# EAGLE board led-matrix-displayCompl (EAGLE 5.12)
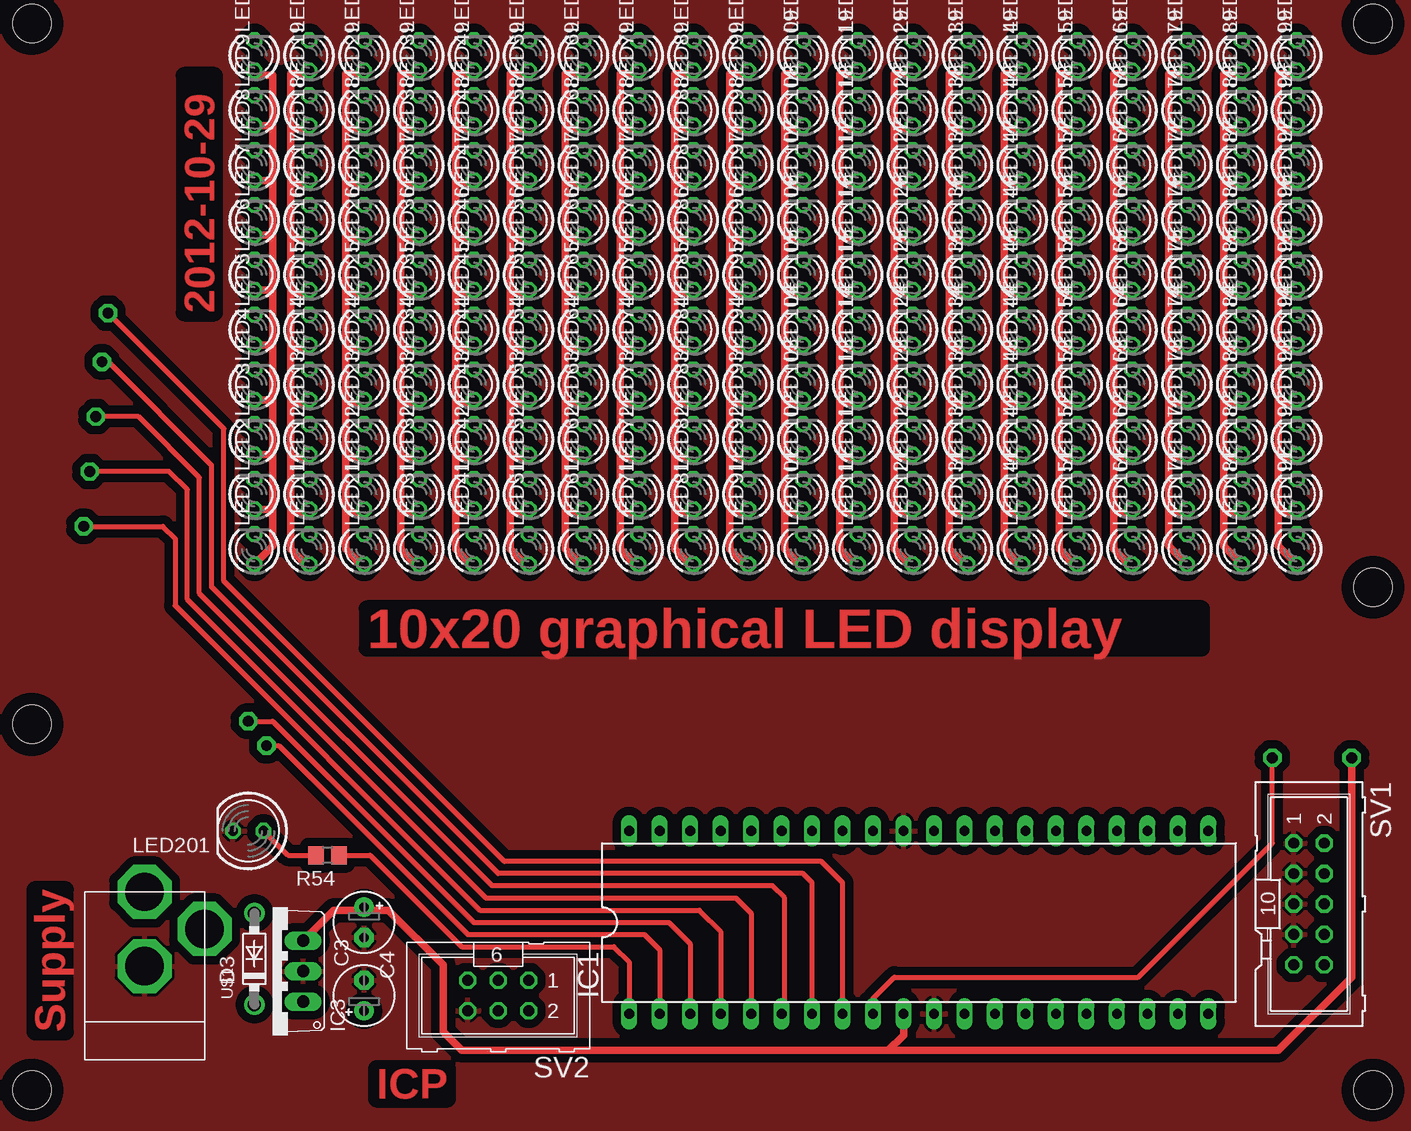
[diagram p1: board, top side]
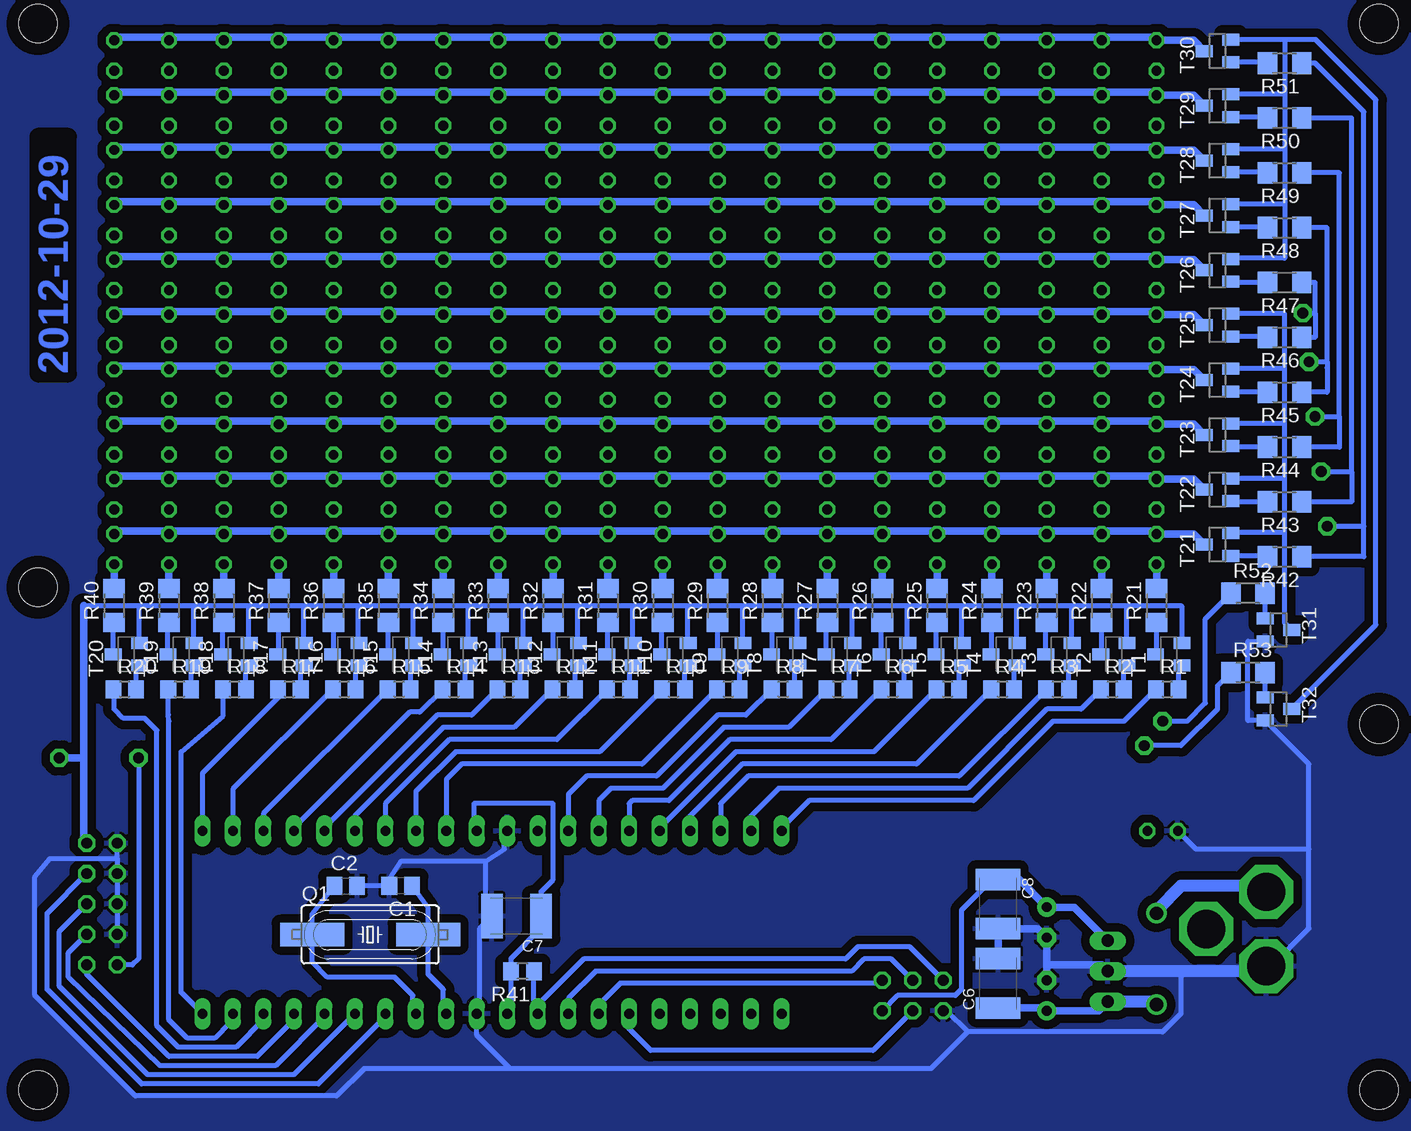
[diagram p2: board, bottom side, seen from below]

No outline drawn. Coordinates in mm, seen from the top.
Copper layers (1*16): Top 0.035mm / dielectric 1.5mm / Bottom 0.035mm
Design rules "default *": minimum track width 16mil, minimum drill 24mil, track to track 12mil, track to pad 12mil, pad to pad 12mil, via to via 8mil, smd to smd 8mil, copper to edge 40mil, drill to drill 8mil, minimum pad ring 10mil, minimum via ring 8mil, stop-mask expansion 4mil, vias tented up to drill 0mil, thermal gap 10mil
Holes 3.2 mm at 105.41,-6.35 105.41,82.55 -6.35,82.55 -6.35,24.13 -6.35,-6.35 105.41,35.56

## Footprints (pad centres in the part's own frame; a part is rotated, then mirrored left to right if it is on the bottom)
C0805 = smd 1.3 x 1.5: 1 -0.95,0; 2 0.95,0
E2,5-5 = drill 0.813 pad 1.6 round: + -1.27,0 | drill 0.813 pad 1.6 octagon: - 1.27,0
C1812K = smd 1.8 x 3.7: 1 -2.05,0; 2 2.05,0
DO41-7.6 = drill 1.1 pad 1.7 round: A 3.81,0; C -3.81,0
DIL40 = drill 0.813 long: 1 -24.13,-7.62; 2 -21.59,-7.62; 3 -19.05,-7.62; 4 -16.51,-7.62; 5 -13.97,-7.62; 6 -11.43,-7.62; 7 -8.89,-7.62; 8 -6.35,-7.62; 9 -3.81,-7.62; 10 -1.27,-7.62; 11 1.27,-7.62; 12 3.81,-7.62; 13 6.35,-7.62; 14 8.89,-7.62; 15 11.43,-7.62; 16 13.97,-7.62; 17 16.51,-7.62; 18 19.05,-7.62; 19 21.59,-7.62; 20 24.13,-7.62; 21 24.13,7.62; 22 21.59,7.62; 23 19.05,7.62; 24 16.51,7.62; 25 13.97,7.62; 26 11.43,7.62; 27 8.89,7.62; 28 6.35,7.62; 29 3.81,7.62; 30 1.27,7.62; 31 -1.27,7.62; 32 -3.81,7.62; 33 -6.35,7.62; 34 -8.89,7.62; 35 -11.43,7.62; 36 -13.97,7.62; 37 -16.51,7.62; 38 -19.05,7.62; 39 -21.59,7.62; 40 -24.13,7.62
TO220V = drill 1.016 long: 1 -2.54,-2.54; 2 0,-2.54; 3 2.54,-2.54
LED3MM = drill 0.813 octagon: A -1.27,0; K 1.27,0
LED5MM = drill 0.813 octagon: A -1.27,0; K 1.27,0
HC49UP = smd 5.334 x 1.93: 1 -4.826,0; 2 4.826,0
R0805 = smd 1.3 x 1.5: 1 -0.95,0; 2 0.95,0
R1206 = smd 1.6 x 1.803: 1 -1.422,0; 2 1.422,0
ML10 = drill 0.914 octagon: 1 -5.08,-1.27; 2 -5.08,1.27; 3 -2.54,-1.27; 4 -2.54,1.27; 5 0,-1.27; 6 0,1.27; 7 2.54,-1.27; 8 2.54,1.27; 9 5.08,-1.27; 10 5.08,1.27
ML6 = drill 0.914 octagon: 1 -2.54,-1.27; 2 -2.54,1.27; 3 0,-1.27; 4 0,1.27; 5 2.54,-1.27; 6 2.54,1.27
SOT23-BEC = smd 1 x 1.4: B -0.95,-1.1; C 0,1.1; E 0.95,-1.1
SOT23 = smd 1 x 1.4: 1 -0.95,-1.1; 2 0.95,-1.1; 3 0,1.1
HOHLBUCHSE = drill 3.2 pad 4.5 octagon: I 0,0; O 6.2,0; O2 3.1,5

## Placement (x,y rotation side)
C1  [C0805]  75.18,10.67 180 bottom
C2  [C0805]  79.76,10.67 0 bottom
C3  [E2,5-5]  21.34,1.52 90 top
C4  [E2,5-5]  21.34,7.62 270 top
C6  [C1812K]  25.4,2.54 90 bottom
C7  [C1812K]  65.53,8.13 180 bottom
C8  [C1812K]  25.4,9.14 270 bottom
D3  1N5817-B  [DO41-7.6]  12.19,4.57 90 top
IC1  MEGA32-P  [DIL40]  67.56,7.62 0 top
IC3  7805TV  [TO220V]  13.72,3.56 90 top
LED1  [LED3MM]  12.19,38.73 90 top
LED2  [LED3MM]  12.19,43.31 90 top
LED3  [LED3MM]  12.19,47.88 90 top
LED4  [LED3MM]  12.19,52.45 90 top
LED5  [LED3MM]  12.19,57.02 90 top
LED6  [LED3MM]  12.19,61.59 90 top
LED7  [LED3MM]  12.19,66.17 90 top
LED8  [LED3MM]  12.19,70.74 90 top
LED9  [LED3MM]  12.19,75.31 90 top
LED10  [LED3MM]  12.19,79.88 90 top
LED11  [LED3MM]  16.76,38.73 90 top
LED12  [LED3MM]  16.76,43.31 90 top
LED13  [LED3MM]  16.76,47.88 90 top
LED14  [LED3MM]  16.76,52.45 90 top
LED15  [LED3MM]  16.76,57.02 90 top
LED16  [LED3MM]  16.76,61.59 90 top
LED17  [LED3MM]  16.76,66.17 90 top
LED18  [LED3MM]  16.76,70.74 90 top
LED19  [LED3MM]  16.76,75.31 90 top
LED20  [LED3MM]  16.76,79.88 90 top
LED21  [LED3MM]  21.34,38.73 90 top
LED22  [LED3MM]  21.34,43.31 90 top
LED23  [LED3MM]  21.34,47.88 90 top
LED24  [LED3MM]  21.34,52.45 90 top
LED25  [LED3MM]  21.34,57.02 90 top
LED26  [LED3MM]  21.34,61.59 90 top
LED27  [LED3MM]  21.34,66.17 90 top
LED28  [LED3MM]  21.34,70.74 90 top
LED29  [LED3MM]  21.34,75.31 90 top
LED30  [LED3MM]  21.34,79.88 90 top
LED31  [LED3MM]  25.91,38.73 90 top
LED32  [LED3MM]  25.91,43.31 90 top
LED33  [LED3MM]  25.91,47.88 90 top
LED34  [LED3MM]  25.91,52.45 90 top
LED35  [LED3MM]  25.91,57.02 90 top
LED36  [LED3MM]  25.91,61.59 90 top
LED37  [LED3MM]  25.91,66.17 90 top
LED38  [LED3MM]  25.91,70.74 90 top
LED39  [LED3MM]  25.91,75.31 90 top
LED40  [LED3MM]  25.91,79.88 90 top
LED41  [LED3MM]  30.48,38.73 90 top
LED42  [LED3MM]  30.48,43.31 90 top
LED43  [LED3MM]  30.48,47.88 90 top
LED44  [LED3MM]  30.48,52.45 90 top
LED45  [LED3MM]  30.48,57.02 90 top
LED46  [LED3MM]  30.48,61.59 90 top
LED47  [LED3MM]  30.48,66.17 90 top
LED48  [LED3MM]  30.48,70.74 90 top
LED49  [LED3MM]  30.48,75.31 90 top
LED50  [LED3MM]  30.48,79.88 90 top
LED51  [LED3MM]  35.05,38.73 90 top
LED52  [LED3MM]  35.05,43.31 90 top
LED53  [LED3MM]  35.05,47.88 90 top
LED54  [LED3MM]  35.05,52.45 90 top
LED55  [LED3MM]  35.05,57.02 90 top
LED56  [LED3MM]  35.05,61.59 90 top
LED57  [LED3MM]  35.05,66.17 90 top
LED58  [LED3MM]  35.05,70.74 90 top
LED59  [LED3MM]  35.05,75.31 90 top
LED60  [LED3MM]  35.05,79.88 90 top
LED61  [LED3MM]  39.62,38.73 90 top
LED62  [LED3MM]  39.62,43.31 90 top
LED63  [LED3MM]  39.62,47.88 90 top
LED64  [LED3MM]  39.62,52.45 90 top
LED65  [LED3MM]  39.62,57.02 90 top
LED66  [LED3MM]  39.62,61.59 90 top
LED67  [LED3MM]  39.62,66.17 90 top
LED68  [LED3MM]  39.62,70.74 90 top
LED69  [LED3MM]  39.62,75.31 90 top
LED70  [LED3MM]  39.62,79.88 90 top
LED71  [LED3MM]  44.2,38.73 90 top
LED72  [LED3MM]  44.2,43.31 90 top
LED73  [LED3MM]  44.2,47.88 90 top
LED74  [LED3MM]  44.2,52.45 90 top
LED75  [LED3MM]  44.2,57.02 90 top
LED76  [LED3MM]  44.2,61.59 90 top
LED77  [LED3MM]  44.2,66.17 90 top
LED78  [LED3MM]  44.2,70.74 90 top
LED79  [LED3MM]  44.2,75.31 90 top
LED80  [LED3MM]  44.2,79.88 90 top
LED81  [LED3MM]  48.77,38.73 90 top
LED82  [LED3MM]  48.77,43.31 90 top
LED83  [LED3MM]  48.77,47.88 90 top
LED84  [LED3MM]  48.77,52.45 90 top
LED85  [LED3MM]  48.77,57.02 90 top
LED86  [LED3MM]  48.77,61.59 90 top
LED87  [LED3MM]  48.77,66.17 90 top
LED88  [LED3MM]  48.77,70.74 90 top
LED89  [LED3MM]  48.77,75.31 90 top
LED90  [LED3MM]  48.77,79.88 90 top
LED91  [LED3MM]  53.34,38.73 90 top
LED92  [LED3MM]  53.34,43.31 90 top
LED93  [LED3MM]  53.34,47.88 90 top
LED94  [LED3MM]  53.34,52.45 90 top
LED95  [LED3MM]  53.34,57.02 90 top
LED96  [LED3MM]  53.34,61.59 90 top
LED97  [LED3MM]  53.34,66.17 90 top
LED98  [LED3MM]  53.34,70.74 90 top
LED99  [LED3MM]  53.34,75.31 90 top
LED100  [LED3MM]  53.34,79.88 90 top
LED101  [LED3MM]  57.91,38.73 90 top
LED102  [LED3MM]  57.91,43.31 90 top
LED103  [LED3MM]  57.91,47.88 90 top
LED104  [LED3MM]  57.91,52.45 90 top
LED105  [LED3MM]  57.91,57.02 90 top
LED106  [LED3MM]  57.91,61.59 90 top
LED107  [LED3MM]  57.91,66.17 90 top
LED108  [LED3MM]  57.91,70.74 90 top
LED109  [LED3MM]  57.91,75.31 90 top
LED110  [LED3MM]  57.91,79.88 90 top
LED111  [LED3MM]  62.48,38.73 90 top
LED112  [LED3MM]  62.48,43.31 90 top
LED113  [LED3MM]  62.48,47.88 90 top
LED114  [LED3MM]  62.48,52.45 90 top
LED115  [LED3MM]  62.48,57.02 90 top
LED116  [LED3MM]  62.48,61.59 90 top
LED117  [LED3MM]  62.48,66.17 90 top
LED118  [LED3MM]  62.48,70.74 90 top
LED119  [LED3MM]  62.48,75.31 90 top
LED120  [LED3MM]  62.48,79.88 90 top
LED121  [LED3MM]  67.06,38.73 90 top
LED122  [LED3MM]  67.06,43.31 90 top
LED123  [LED3MM]  67.06,47.88 90 top
LED124  [LED3MM]  67.06,52.45 90 top
LED125  [LED3MM]  67.06,57.02 90 top
LED126  [LED3MM]  67.06,61.59 90 top
LED127  [LED3MM]  67.06,66.17 90 top
LED128  [LED3MM]  67.06,70.74 90 top
LED129  [LED3MM]  67.06,75.31 90 top
LED130  [LED3MM]  67.06,79.88 90 top
LED131  [LED3MM]  71.63,38.73 90 top
LED132  [LED3MM]  71.63,43.31 90 top
LED133  [LED3MM]  71.63,47.88 90 top
LED134  [LED3MM]  71.63,52.45 90 top
LED135  [LED3MM]  71.63,57.02 90 top
LED136  [LED3MM]  71.63,61.59 90 top
LED137  [LED3MM]  71.63,66.17 90 top
LED138  [LED3MM]  71.63,70.74 90 top
LED139  [LED3MM]  71.63,75.31 90 top
LED140  [LED3MM]  71.63,79.88 90 top
LED141  [LED3MM]  76.2,38.73 90 top
LED142  [LED3MM]  76.2,43.31 90 top
LED143  [LED3MM]  76.2,47.88 90 top
LED144  [LED3MM]  76.2,52.45 90 top
LED145  [LED3MM]  76.2,57.02 90 top
LED146  [LED3MM]  76.2,61.59 90 top
LED147  [LED3MM]  76.2,66.17 90 top
LED148  [LED3MM]  76.2,70.74 90 top
LED149  [LED3MM]  76.2,75.31 90 top
LED150  [LED3MM]  76.2,79.88 90 top
LED151  [LED3MM]  80.77,38.73 90 top
LED152  [LED3MM]  80.77,43.31 90 top
LED153  [LED3MM]  80.77,47.88 90 top
LED154  [LED3MM]  80.77,52.45 90 top
LED155  [LED3MM]  80.77,57.02 90 top
LED156  [LED3MM]  80.77,61.59 90 top
LED157  [LED3MM]  80.77,66.17 90 top
LED158  [LED3MM]  80.77,70.74 90 top
LED159  [LED3MM]  80.77,75.31 90 top
LED160  [LED3MM]  80.77,79.88 90 top
LED161  [LED3MM]  85.34,38.73 90 top
LED162  [LED3MM]  85.34,43.31 90 top
LED163  [LED3MM]  85.34,47.88 90 top
LED164  [LED3MM]  85.34,52.45 90 top
LED165  [LED3MM]  85.34,57.02 90 top
LED166  [LED3MM]  85.34,61.59 90 top
LED167  [LED3MM]  85.34,66.17 90 top
LED168  [LED3MM]  85.34,70.74 90 top
LED169  [LED3MM]  85.34,75.31 90 top
LED170  [LED3MM]  85.34,79.88 90 top
LED171  [LED3MM]  89.92,38.73 90 top
LED172  [LED3MM]  89.92,43.31 90 top
LED173  [LED3MM]  89.92,47.88 90 top
LED174  [LED3MM]  89.92,52.45 90 top
LED175  [LED3MM]  89.92,57.02 90 top
LED176  [LED3MM]  89.92,61.59 90 top
LED177  [LED3MM]  89.92,66.17 90 top
LED178  [LED3MM]  89.92,70.74 90 top
LED179  [LED3MM]  89.92,75.31 90 top
LED180  [LED3MM]  89.92,79.88 90 top
LED181  [LED3MM]  94.49,38.73 90 top
LED182  [LED3MM]  94.49,43.31 90 top
LED183  [LED3MM]  94.49,47.88 90 top
LED184  [LED3MM]  94.49,52.45 90 top
LED185  [LED3MM]  94.49,57.02 90 top
LED186  [LED3MM]  94.49,61.59 90 top
LED187  [LED3MM]  94.49,66.17 90 top
LED188  [LED3MM]  94.49,70.74 90 top
LED189  [LED3MM]  94.49,75.31 90 top
LED190  [LED3MM]  94.49,79.88 90 top
LED191  [LED3MM]  99.06,38.73 90 top
LED192  [LED3MM]  99.06,43.31 90 top
LED193  [LED3MM]  99.06,47.88 90 top
LED194  [LED3MM]  99.06,52.45 90 top
LED195  [LED3MM]  99.06,57.02 90 top
LED196  [LED3MM]  99.06,61.59 90 top
LED197  [LED3MM]  99.06,66.17 90 top
LED198  [LED3MM]  99.06,70.74 90 top
LED199  [LED3MM]  99.06,75.31 90 top
LED200  [LED3MM]  99.06,79.88 90 top
LED201  [LED5MM]  11.68,15.24 180 top
Q1  [HC49UP]  77.72,6.6 0 bottom
R1  10k  [R0805]  11.3,27.05 0 bottom
R2  10k  [R0805]  15.88,27.05 0 bottom
R3  10k  [R0805]  20.45,27.05 0 bottom
R4  10k  [R0805]  25.02,27.05 0 bottom
R5  10k  [R0805]  29.59,27.05 0 bottom
R6  10k  [R0805]  34.16,27.05 0 bottom
R7  10k  [R0805]  38.73,27.05 0 bottom
R8  10k  [R0805]  43.31,27.05 0 bottom
R9  10k  [R0805]  47.88,27.05 0 bottom
R10  10k  [R0805]  52.45,27.05 0 bottom
R11  10k  [R0805]  57.02,27.05 0 bottom
R12  10k  [R0805]  61.59,27.05 0 bottom
R13  10k  [R0805]  66.17,27.05 0 bottom
R14  10k  [R0805]  70.74,27.05 0 bottom
R15  10k  [R0805]  75.31,27.05 0 bottom
R16  10k  [R0805]  79.88,27.05 0 bottom
R17  10k  [R0805]  84.45,27.05 0 bottom
R18  10k  [R0805]  89.03,27.05 0 bottom
R19  10k  [R0805]  93.6,27.05 0 bottom
R20  10k  [R0805]  98.17,27.05 0 bottom
R21  [R1206]  12.19,34.04 90 bottom
R22  [R1206]  16.76,34.04 90 bottom
R23  [R1206]  21.34,34.04 90 bottom
R24  [R1206]  25.91,34.04 90 bottom
R25  [R1206]  30.48,34.04 90 bottom
R26  [R1206]  35.05,34.04 90 bottom
R27  [R1206]  39.62,34.04 90 bottom
R28  [R1206]  44.2,34.04 90 bottom
R29  [R1206]  48.77,34.04 90 bottom
R30  [R1206]  53.34,34.04 90 bottom
R31  [R1206]  57.91,34.04 90 bottom
R32  [R1206]  62.48,34.04 90 bottom
R33  [R1206]  67.06,34.04 90 bottom
R34  [R1206]  71.63,34.04 90 bottom
R35  [R1206]  76.2,34.04 90 bottom
R36  [R1206]  80.77,34.04 90 bottom
R37  [R1206]  85.34,34.04 90 bottom
R38  [R1206]  89.92,34.04 90 bottom
R39  [R1206]  94.49,34.04 90 bottom
R40  [R1206]  99.06,34.04 90 bottom
R41  [R0805]  65.02,3.56 180 bottom
R42  4k7  [R1206]  1.52,38.1 180 bottom
R43  4k7  [R1206]  1.52,42.67 180 bottom
R44  4k7  [R1206]  1.52,47.24 180 bottom
R45  4k7  [R1206]  1.52,51.82 180 bottom
R46  4k7  [R1206]  1.52,56.39 180 bottom
R47  4k7  [R1206]  1.52,60.96 180 bottom
R48  4k7  [R1206]  1.52,65.53 180 bottom
R49  4k7  [R1206]  1.52,70.1 180 bottom
R50  4k7  [R1206]  1.52,74.68 180 bottom
R51  4k7  [R1206]  1.52,79.25 180 bottom
R52  4k7  [R1206]  4.57,35.05 0 bottom
R53  4k7  [R1206]  4.57,28.45 0 bottom
R54  [R0805]  18.29,13.21 180 top
SV1  [ML10]  100.08,9.14 270 top
SV2  [ML6]  32.51,1.52 180 top
T1  [SOT23-BEC]  11.18,29.97 90 bottom
T2  [SOT23-BEC]  15.75,29.97 90 bottom
T3  [SOT23-BEC]  20.32,29.97 90 bottom
T4  [SOT23-BEC]  24.89,29.97 90 bottom
T5  [SOT23-BEC]  29.46,29.97 90 bottom
T6  [SOT23-BEC]  34.04,29.97 90 bottom
T7  [SOT23-BEC]  38.61,29.97 90 bottom
T8  [SOT23-BEC]  43.18,29.97 90 bottom
T9  [SOT23-BEC]  47.75,29.97 90 bottom
T10  [SOT23-BEC]  52.32,29.97 90 bottom
T11  [SOT23-BEC]  56.9,29.97 90 bottom
T12  [SOT23-BEC]  61.47,29.97 90 bottom
T13  [SOT23-BEC]  66.04,29.97 90 bottom
T14  [SOT23-BEC]  70.61,29.97 90 bottom
T15  [SOT23-BEC]  75.18,29.97 90 bottom
T16  [SOT23-BEC]  79.76,29.97 90 bottom
T17  [SOT23-BEC]  84.33,29.97 90 bottom
T18  [SOT23-BEC]  88.9,29.97 90 bottom
T19  [SOT23-BEC]  93.47,29.97 90 bottom
T20  [SOT23-BEC]  98.04,29.97 90 bottom
T21  BC818  [SOT23]  7.11,39.12 90 bottom
T22  BC818  [SOT23]  7.11,43.69 90 bottom
T23  BC818  [SOT23]  7.11,48.26 90 bottom
T24  BC818  [SOT23]  7.11,52.83 90 bottom
T25  BC818  [SOT23]  7.11,57.4 90 bottom
T26  BC818  [SOT23]  7.11,61.98 90 bottom
T27  BC818  [SOT23]  7.11,66.55 90 bottom
T28  BC818  [SOT23]  7.11,71.12 90 bottom
T29  BC818  [SOT23]  7.11,75.69 90 bottom
T30  BC818  [SOT23]  7.11,80.26 90 bottom
T31  BC818  [SOT23]  2.03,32 270 bottom
T32  BC818  [SOT23]  2.03,25.4 270 bottom
U$1  HOHLBUCHSE  [HOHLBUCHSE]  3.05,10.16 270 top

## Tracks (layer width: path | path; a pad name or v marks a point on that pad's centre or on a via)
+5V  (via drill 0.9 pad 1.52)
  Top 0.61: IC3.3 18.8,8.64 23.37,8.64 27.94,4.06 27.94,-1.52 29.46,-3.05 65.02,-3.05 | 65.02,-3.05 66.29,-1.78 IC1.10 | 65.02,-3.05 97.54,-3.05 103.63,3.05 v103.63,21.34
  Bottom 0.406: IC1.10 65.97,0.32 R41.2 65.97,4.62 63.5,7.11 63.5,8.13 C7.1 63.48,10.18 62.48,11.18 62.48,17.53 69.09,17.53 69.09,15.49 IC1.30 | 101.6,14.48 SV1.2 | 14.73,34.04 10.16,34.04 10.08,33.95 T1.E | 19.3,34.04 14.73,34.04 | 23.88,34.04 19.3,34.04 | 28.45,34.04 23.88,34.04 | 33.02,34.04 28.45,34.04 | 37.59,34.04 33.02,34.04 | 42.16,34.04 37.59,34.04 | 46.74,34.04 42.16,34.04 | 51.31,34.04 46.74,34.04 | 55.88,34.04 51.31,34.04 | 60.45,34.04 55.88,34.04 | 65.02,34.04 60.45,34.04 | 69.6,34.04 65.02,34.04 | 74.17,34.04 69.6,34.04 | 78.74,34.04 74.17,34.04 | 83.31,34.04 78.74,34.04 | 87.88,34.04 83.31,34.04 | 92.46,34.04 87.88,34.04 | 97.03,34.04 92.46,34.04 | 101.6,34.04 97.03,34.04 | T2.E 14.73,31.01 14.73,34.04 | T3.E 19.3,31.01 19.3,34.04 | T4.E 23.88,31.01 23.88,34.04 | T5.E 28.45,31.01 28.45,34.04 | T6.E 33.02,31.01 33.02,34.04 | T7.E 37.59,31.01 37.59,34.04 | T8.E 42.16,31.01 42.16,34.04 | T9.E 46.74,31.01 46.74,34.04 | T10.E 51.31,31.01 51.31,34.04 | T12.E 60.45,31.01 60.45,34.04 | T11.E 55.88,31.01 55.88,34.04 | T13.E 65.02,31.01 65.02,34.04 | T14.E 69.6,31.01 69.6,34.04 | T15.E 74.17,31.01 74.17,34.04 | T16.E 78.74,31.01 78.74,34.04 | T17.E 83.31,31.01 83.31,34.04 | T18.E 87.88,31.01 87.88,34.04 | T19.E 92.46,31.01 92.46,34.04 | T20.E 97.03,31.01 97.03,34.04 | SV2.2 33.78,1.52 28.96,1.52 28.45,2.03 28.45,8.64 25.89,11.19 C8.1
  Bottom 0.61: IC3.3 19.05,8.89 C4.+ 23.64,11.19 C8.1 | 101.6,21.34 101.6,34.04 | 101.6,21.34 101.6,14.48 | v103.63,21.34 101.6,21.34
GND
  Bottom 0.406: C2.2 C1.2 76.13,11.24 75.18,12.7 68.07,12.7 | IC1.31 66.55,14.99 66.55,13.72 68.07,12.7 | 68.07,12.7 68.07,8.62 C7.2 67.58,8.11 68.58,7.11 68.58,0.25 IC1.11 68.83,-1.78 66.04,-4.57 | SV1.7 SV1.5 SV1.3 98.81,12.94 | 98.81,12.94 SV1.1 | 9.65,3.56 10.16,3.05 10.16,0 11.68,-1.52 27.94,-1.52 | 27.94,-1.52 29.72,0.25 SV2.6 | T31.2 4.57,31.05 4.57,24.45 T32.2 -0.51,20.81 -0.51,13.72 | -0.51,13.72 -0.51,7.11 2.64,3.96 U$1.O | LED201.K 8.89,13.72 -0.51,13.72 | 27.94,-1.52 30.99,-4.57 66.04,-4.57 | 98.81,12.94 98.83,12.95 104.39,12.95 105.66,11.43 105.66,1.52 97.28,-6.86 80.52,-6.86 78.23,-4.57 66.04,-4.57
  Bottom 0.61: C6.2 C8.2 22.08,7.09 C4.- 21.34,4.06 | 21.34,4.06 C3.- | IC3.2 16.76,4.06 21.34,4.06
  Bottom 1.016: U$1.O 3.45,3.56 9.65,3.56 IC3.2
  pour Top (isolate 0.711): 109.22,-10.16 109.22,86.36 -10.16,86.36 -10.16,-10.16
  pour Bottom (isolate 0.711): 109.22,-10.16 109.22,86.36 -10.16,86.36 -10.16,-10.16
N$1
  Top 0.61: LED1.A 13.72,38.99 13.72,42.04 | 13.72,69.47 13.72,74.04 | LED10.A arc90 12.57,78.23 13.72,78.23 13.72,74.04 | 13.72,74.04 LED9.A | 13.72,69.47 LED8.A | 13.72,64.9 LED7.A | 13.72,64.9 13.72,69.47 | 13.72,60.33 LED6.A | 13.72,60.33 13.72,64.9 | 13.72,55.75 LED5.A | 13.72,55.75 13.72,60.33 | 13.72,51.18 LED4.A | 13.72,51.18 13.72,55.75 | 13.72,46.61 LED3.A | 13.72,46.61 13.72,51.18 | 13.72,42.04 LED2.A | 13.72,42.04 13.72,46.61
  Bottom 0.61: R21.2 LED1.A
N$2
  Top 0.61: 16.76,37.21 15.24,38.73 15.24,41.78 | 15.24,41.78 16.76,41.78 LED12.A | 15.24,46.35 16.76,46.35 LED13.A | 15.24,41.78 15.24,46.35 | 15.24,50.93 16.76,50.93 LED14.A | 15.24,46.35 15.24,50.93 | 15.24,55.5 16.76,55.5 LED15.A | 15.24,50.93 15.24,55.5 | 15.24,60.07 16.76,60.07 LED16.A | 15.24,55.5 15.24,60.07 | 15.24,64.64 16.76,64.64 LED17.A | 15.24,60.07 15.24,64.64 | 15.24,69.22 16.76,69.22 LED18.A | 15.24,64.64 15.24,69.22 | 15.24,73.79 16.76,73.79 LED19.A | 15.24,69.22 15.24,73.79 | 15.24,73.79 15.24,78.36 16.76,78.36 LED20.A | 16.76,37.21 16.51,37.21 | LED11.A 16.76,37.21
  Bottom 0.61: R22.2 LED11.A
N$3
  Top 0.61: 21.34,37.21 19.81,38.73 19.81,41.78 | 19.81,41.78 21.34,41.78 LED22.A | 19.81,46.35 21.34,46.35 LED23.A | 19.81,41.78 19.81,46.35 | 19.81,50.93 21.34,50.93 LED24.A | 19.81,46.35 19.81,50.93 | 19.81,55.5 21.34,55.5 LED25.A | 19.81,50.93 19.81,55.5 | 19.81,60.07 21.34,60.07 LED26.A | 19.81,55.5 19.81,60.07 | 19.81,64.64 21.34,64.64 LED27.A | 19.81,60.07 19.81,64.64 | 19.81,69.22 21.34,69.22 LED28.A | 19.81,64.64 19.81,69.22 | 19.81,73.79 21.34,73.79 LED29.A | 19.81,69.22 19.81,73.79 | 19.81,73.79 19.81,78.36 21.34,78.36 LED30.A | 21.34,37.21 21.08,37.21 | LED21.A 21.34,37.21
  Bottom 0.61: R23.2 LED21.A
N$4
  Top 0.61: 24.38,41.78 24.38,38.73 25.65,37.47 LED31.A | 24.38,41.78 25.91,41.78 LED32.A | 24.38,46.35 25.91,46.35 LED33.A | 24.38,41.78 24.38,46.35 | 24.38,50.93 25.91,50.93 LED34.A | 24.38,46.35 24.38,50.93 | 24.38,55.5 25.91,55.5 LED35.A | 24.38,50.93 24.38,55.5 | 24.38,60.07 25.91,60.07 LED36.A | 24.38,55.5 24.38,60.07 | 24.38,64.64 25.91,64.64 LED37.A | 24.38,60.07 24.38,64.64 | 24.38,69.22 25.91,69.22 LED38.A | 24.38,64.64 24.38,69.22 | 24.38,73.79 25.91,73.79 LED39.A | 24.38,69.22 24.38,73.79 | 24.38,73.79 24.38,78.36 25.91,78.36 LED40.A
  Bottom 0.61: R24.2 LED31.A
N$5
  Top 0.61: 30.23,37.47 30.48,37.21 30.23,37.21 | 28.96,41.78 28.96,38.73 30.23,37.47 | 28.96,41.78 30.48,41.78 LED42.A | 28.96,46.35 30.48,46.35 LED43.A | 28.96,41.78 28.96,46.35 | 28.96,50.93 30.48,50.93 LED44.A | 28.96,46.35 28.96,50.93 | 28.96,55.5 30.48,55.5 LED45.A | 28.96,50.93 28.96,55.5 | 28.96,60.07 30.48,60.07 LED46.A | 28.96,55.5 28.96,60.07 | 28.96,64.64 30.48,64.64 LED47.A | 28.96,60.07 28.96,64.64 | 28.96,69.22 30.48,69.22 LED48.A | 28.96,64.64 28.96,69.22 | 28.96,73.79 30.48,73.79 LED49.A | 28.96,69.22 28.96,73.79 | 28.96,73.79 28.96,78.36 30.48,78.36 LED50.A | LED41.A 30.23,37.47
  Bottom 0.61: R25.2 LED41.A
N$6
  Top 0.61: 35.05,37.21 33.53,38.73 33.53,41.78 | 33.53,41.78 35.05,41.78 LED52.A | 33.53,46.35 35.05,46.35 LED53.A | 33.53,41.78 33.53,46.35 | 33.53,50.93 35.05,50.93 LED54.A | 33.53,46.35 33.53,50.93 | 33.53,55.5 35.05,55.5 LED55.A | 33.53,50.93 33.53,55.5 | 33.53,60.07 35.05,60.07 LED56.A | 33.53,55.5 33.53,60.07 | 33.53,64.64 35.05,64.64 LED57.A | 33.53,60.07 33.53,64.64 | 33.53,69.22 35.05,69.22 LED58.A | 33.53,64.64 33.53,69.22 | 33.53,73.79 35.05,73.79 LED59.A | 33.53,69.22 33.53,73.79 | 33.53,73.79 33.53,78.36 35.05,78.36 LED60.A | 35.05,37.21 34.8,37.21 | LED51.A 35.05,37.21
  Bottom 0.61: R26.2 LED51.A
N$7
  Top 0.61: 39.62,37.21 38.1,38.73 38.1,41.78 | 38.1,41.78 39.62,41.78 LED62.A | 38.1,46.35 39.62,46.35 LED63.A | 38.1,41.78 38.1,46.35 | 38.1,50.93 39.62,50.93 LED64.A | 38.1,46.35 38.1,50.93 | 38.1,55.5 39.62,55.5 LED65.A | 38.1,50.93 38.1,55.5 | 38.1,60.07 39.62,60.07 LED66.A | 38.1,55.5 38.1,60.07 | 38.1,64.64 39.62,64.64 LED67.A | 38.1,60.07 38.1,64.64 | 38.1,69.22 39.62,69.22 LED68.A | 38.1,64.64 38.1,69.22 | 38.1,73.79 39.62,73.79 LED69.A | 38.1,69.22 38.1,73.79 | 38.1,73.79 38.1,78.36 39.62,78.36 LED70.A | 39.62,37.21 39.37,37.21 | LED61.A 39.62,37.21
  Bottom 0.61: R27.2 LED61.A
N$8
  Top 0.61: 44.2,37.21 42.67,38.73 42.67,41.78 | 42.67,41.78 44.2,41.78 LED72.A | 42.67,46.35 44.2,46.35 LED73.A | 42.67,41.78 42.67,46.35 | 42.67,50.93 44.2,50.93 LED74.A | 42.67,46.35 42.67,50.93 | 42.67,55.5 44.2,55.5 LED75.A | 42.67,50.93 42.67,55.5 | 42.67,60.07 44.2,60.07 LED76.A | 42.67,55.5 42.67,60.07 | 42.67,64.64 44.2,64.64 LED77.A | 42.67,60.07 42.67,64.64 | 42.67,69.22 44.2,69.22 LED78.A | 42.67,64.64 42.67,69.22 | 42.67,73.79 44.2,73.79 LED79.A | 42.67,69.22 42.67,73.79 | 42.67,73.79 42.67,78.36 44.2,78.36 LED80.A | 44.2,37.21 43.94,37.21 | LED71.A 44.2,37.21
  Bottom 0.61: R28.2 LED71.A
N$9
  Top 0.61: 48.77,37.21 47.24,38.73 47.24,41.78 | 47.24,41.78 48.77,41.78 LED82.A | 47.24,46.35 48.77,46.35 LED83.A | 47.24,41.78 47.24,46.35 | 47.24,50.93 48.77,50.93 LED84.A | 47.24,46.35 47.24,50.93 | 47.24,55.5 48.77,55.5 LED85.A | 47.24,50.93 47.24,55.5 | 47.24,60.07 48.77,60.07 LED86.A | 47.24,55.5 47.24,60.07 | 47.24,64.64 48.77,64.64 LED87.A | 47.24,60.07 47.24,64.64 | 47.24,69.22 48.77,69.22 LED88.A | 47.24,64.64 47.24,69.22 | 47.24,73.79 48.77,73.79 LED89.A | 47.24,69.22 47.24,73.79 | 47.24,73.79 47.24,78.36 48.77,78.36 LED90.A | 48.77,37.21 48.51,37.21 | LED81.A 48.77,37.21
  Bottom 0.61: R29.2 LED81.A
N$10
  Top 0.61: 53.09,37.47 53.34,37.21 53.09,37.21 | 51.82,41.78 51.82,38.73 53.09,37.47 | 51.82,41.78 53.34,41.78 LED92.A | 51.82,46.35 53.34,46.35 LED93.A | 51.82,41.78 51.82,46.35 | 51.82,50.93 53.34,50.93 LED94.A | 51.82,46.35 51.82,50.93 | 51.82,55.5 53.34,55.5 LED95.A | 51.82,50.93 51.82,55.5 | 51.82,60.07 53.34,60.07 LED96.A | 51.82,55.5 51.82,60.07 | 51.82,64.64 53.34,64.64 LED97.A | 51.82,60.07 51.82,64.64 | 51.82,69.22 53.34,69.22 LED98.A | 51.82,64.64 51.82,69.22 | 51.82,73.79 53.34,73.79 LED99.A | 51.82,69.22 51.82,73.79 | 51.82,73.79 51.82,78.36 53.34,78.36 LED100.A | LED91.A 53.09,37.47
  Bottom 0.61: R30.2 LED91.A
N$11
  Top 0.61: 57.91,37.21 56.39,38.73 56.39,41.78 | 56.39,41.78 57.91,41.78 LED102.A | 56.39,46.35 57.91,46.35 LED103.A | 56.39,41.78 56.39,46.35 | 56.39,50.93 57.91,50.93 LED104.A | 56.39,46.35 56.39,50.93 | 56.39,55.5 57.91,55.5 LED105.A | 56.39,50.93 56.39,55.5 | 56.39,60.07 57.91,60.07 LED106.A | 56.39,55.5 56.39,60.07 | 56.39,64.64 57.91,64.64 LED107.A | 56.39,60.07 56.39,64.64 | 56.39,69.22 57.91,69.22 LED108.A | 56.39,64.64 56.39,69.22 | 56.39,73.79 57.91,73.79 LED109.A | 56.39,69.22 56.39,73.79 | 56.39,73.79 56.39,78.36 57.91,78.36 LED110.A | 57.91,37.21 57.66,37.21 | LED101.A 57.91,37.21
  Bottom 0.61: R31.2 LED101.A
N$12
  Top 0.61: 62.48,37.21 60.96,38.73 60.96,41.78 | 60.96,41.78 62.48,41.78 LED112.A | 60.96,46.35 62.48,46.35 LED113.A | 60.96,41.78 60.96,46.35 | 60.96,50.93 62.48,50.93 LED114.A | 60.96,46.35 60.96,50.93 | 60.96,55.5 62.48,55.5 LED115.A | 60.96,50.93 60.96,55.5 | 60.96,60.07 62.48,60.07 LED116.A | 60.96,55.5 60.96,60.07 | 60.96,64.64 62.48,64.64 LED117.A | 60.96,60.07 60.96,64.64 | 60.96,69.22 62.48,69.22 LED118.A | 60.96,64.64 60.96,69.22 | 60.96,73.79 62.48,73.79 LED119.A | 60.96,69.22 60.96,73.79 | 60.96,73.79 60.96,78.36 62.48,78.36 LED120.A | 62.48,37.21 62.23,37.21 | LED111.A 62.48,37.21
  Bottom 0.61: R32.2 LED111.A
N$13
  Top 0.61: 66.8,37.47 67.06,37.21 66.8,37.21 | 65.53,41.78 65.53,38.73 66.8,37.47 | 65.53,41.78 67.06,41.78 LED122.A | 65.53,46.35 67.06,46.35 LED123.A | 65.53,41.78 65.53,46.35 | 65.53,50.93 67.06,50.93 LED124.A | 65.53,46.35 65.53,50.93 | 65.53,55.5 67.06,55.5 LED125.A | 65.53,50.93 65.53,55.5 | 65.53,60.07 67.06,60.07 LED126.A | 65.53,55.5 65.53,60.07 | 65.53,64.64 67.06,64.64 LED127.A | 65.53,60.07 65.53,64.64 | 65.53,69.22 67.06,69.22 LED128.A | 65.53,64.64 65.53,69.22 | 65.53,73.79 67.06,73.79 LED129.A | 65.53,69.22 65.53,73.79 | 65.53,73.79 65.53,78.36 67.06,78.36 LED130.A | LED121.A 66.8,37.47
  Bottom 0.61: R33.2 LED121.A
N$14  (via drill 0.9 pad 1.52)
  Top 0.406: v97.03,21.34 97.03,14.22 85.85,3.05 65.53,3.05 63.75,1.27 IC1.9
  Bottom 0.406: SV2.5 32.77,5.59 37.08,5.59 38.1,4.57 59.94,4.57 63.75,0.76 | 63.75,0.76 IC1.9 | 63.75,0.76 64.07,1.08 R41.1 | SV1.9 97.54,4.06 97.03,4.57 v97.03,21.34
N$15
  Top 0.61: 76.2,37.21 74.68,38.73 74.68,41.78 | 74.68,41.78 76.2,41.78 LED142.A | 74.68,46.35 76.2,46.35 LED143.A | 74.68,41.78 74.68,46.35 | 74.68,50.93 76.2,50.93 LED144.A | 74.68,46.35 74.68,50.93 | 74.68,55.5 76.2,55.5 LED145.A | 74.68,50.93 74.68,55.5 | 74.68,60.07 76.2,60.07 LED146.A | 74.68,55.5 74.68,60.07 | 74.68,64.64 76.2,64.64 LED147.A | 74.68,60.07 74.68,64.64 | 74.68,69.22 76.2,69.22 LED148.A | 74.68,64.64 74.68,69.22 | 74.68,73.79 76.2,73.79 LED149.A | 74.68,69.22 74.68,73.79 | 74.68,73.79 74.68,78.36 76.2,78.36 LED150.A | 76.2,37.21 75.95,37.21 | LED141.A 76.2,37.21
  Bottom 0.61: R35.2 LED141.A
N$16
  Top 0.61: 80.77,37.21 79.25,38.73 79.25,41.78 | 79.25,41.78 80.77,41.78 LED152.A | 79.25,46.35 80.77,46.35 LED153.A | 79.25,41.78 79.25,46.35 | 79.25,50.93 80.77,50.93 LED154.A | 79.25,46.35 79.25,50.93 | 79.25,55.5 80.77,55.5 LED155.A | 79.25,50.93 79.25,55.5 | 79.25,60.07 80.77,60.07 LED156.A | 79.25,55.5 79.25,60.07 | 79.25,64.64 80.77,64.64 LED157.A | 79.25,60.07 79.25,64.64 | 79.25,69.22 80.77,69.22 LED158.A | 79.25,64.64 79.25,69.22 | 79.25,73.79 80.77,73.79 LED159.A | 79.25,69.22 79.25,73.79 | 79.25,73.79 79.25,78.36 80.77,78.36 LED160.A | 80.77,37.21 80.52,37.21 | LED151.A 80.77,37.21
  Bottom 0.61: R36.2 LED151.A
N$17
  Top 0.61: 85.34,37.21 83.82,38.73 83.82,41.78 | 83.82,41.78 85.34,41.78 LED162.A | 83.82,46.35 85.34,46.35 LED163.A | 83.82,41.78 83.82,46.35 | 83.82,50.93 85.34,50.93 LED164.A | 83.82,46.35 83.82,50.93 | 83.82,55.5 85.34,55.5 LED165.A | 83.82,50.93 83.82,55.5 | 83.82,60.07 85.34,60.07 LED166.A | 83.82,55.5 83.82,60.07 | 83.82,64.64 85.34,64.64 LED167.A | 83.82,60.07 83.82,64.64 | 83.82,69.22 85.34,69.22 LED168.A | 83.82,64.64 83.82,69.22 | 83.82,73.79 85.34,73.79 LED169.A | 83.82,69.22 83.82,73.79 | 83.82,73.79 83.82,78.36 85.34,78.36 LED170.A | 85.34,37.21 85.09,37.21 | LED161.A 85.34,37.21
  Bottom 0.61: R37.2 LED161.A
N$18
  Bottom 0.406: R20.1 99.06,26.99 99.06,25.4 98.3,24.64 96.52,24.64 95.5,23.62 95.5,-1.02 93.73,-2.79 88.9,-2.79 86.61,-0.51 IC1.18
N$19
  Top 0.61: 92.96,46.35 94.49,46.35 LED183.A | 92.96,50.93 94.49,50.93 LED184.A | 92.96,46.35 92.96,50.93 | 92.96,55.5 94.49,55.5 LED185.A | 92.96,50.93 92.96,55.5 | 92.96,60.07 94.49,60.07 LED186.A | 92.96,55.5 92.96,60.07 | 92.96,64.64 94.49,64.64 LED187.A | 92.96,60.07 92.96,64.64 | 92.96,69.22 94.49,69.22 LED188.A | 92.96,64.64 92.96,69.22 | 92.96,73.79 94.49,73.79 LED189.A | 92.96,69.22 92.96,73.79 | 92.96,73.79 92.96,78.36 94.49,78.36 LED190.A | 92.96,41.78 92.96,38.99 LED181.A | 92.96,41.78 92.96,46.35 | 92.96,41.78 94.49,41.78 LED182.A
  Bottom 0.61: R39.2 LED181.A
N$20
  Bottom 0.406: IC1.19 89.41,-0.76 90.68,-2.03 92.96,-2.03 94.49,-0.51 94.49,24.38 94.55,24.95 R19.1
N$21
  Bottom 0.61: LED191.K 98.81,40.26 94.49,40.26 | 16.76,40.26 12.19,40.26 LED1.K 9.1,40.01 T21.3 | 16.76,40.26 21.34,40.26 | 21.34,40.26 26.04,40.26 | 26.04,40.26 30.61,40.26 | 30.61,40.26 35.05,40.26 | 35.05,40.26 39.75,40.26 | 39.75,40.26 44.2,40.26 | 44.2,40.26 48.77,40.26 | 48.77,40.26 53.47,40.26 | 53.47,40.26 57.91,40.26 | 57.91,40.26 62.48,40.26 | 62.48,40.26 67.06,40.26 | 67.06,40.26 71.63,40.26 | 71.63,40.26 76.33,40.26 | 76.33,40.26 80.9,40.26 | 80.9,40.26 85.34,40.26 | 85.34,40.26 89.92,40.26 | 89.92,40.26 94.49,40.26 | 16.76,40.26 LED11.K | 21.34,40.26 LED21.K | LED31.K 26.04,40.01 26.04,40.26 | LED41.K 30.61,40.01 30.61,40.26 | 35.05,40.26 LED51.K | LED61.K 39.75,40.01 39.75,40.26 | 44.2,40.26 LED71.K | 48.77,40.26 LED81.K | LED91.K 53.47,40.01 53.47,40.26 | 57.91,40.26 LED101.K | 62.48,40.26 LED111.K | 67.06,40.26 LED121.K | 71.63,40.26 LED131.K | LED141.K 76.33,40.01 76.33,40.26 | LED151.K 80.9,40.01 80.9,40.26 | 85.34,40.26 LED161.K | 89.92,40.26 LED171.K | 94.49,40.26 LED181.K
N$22
  Bottom 0.61: 16.76,44.83 12.19,44.83 LED2.K 9.1,44.58 T22.3 | 16.76,44.83 21.34,44.83 | 16.76,44.83 LED12.K | 21.34,44.83 25.91,44.83 | 21.34,44.83 LED22.K | 25.91,44.83 30.48,44.83 | 25.91,44.83 LED32.K | 30.48,44.83 35.05,44.83 | 30.48,44.83 LED42.K | 35.05,44.83 39.62,44.83 | 35.05,44.83 LED52.K | 39.62,44.83 44.2,44.83 | 39.62,44.83 LED62.K | 44.2,44.83 48.77,44.83 | 44.2,44.83 LED72.K | 48.77,44.83 53.34,44.83 | 48.77,44.83 LED82.K | 53.34,44.83 57.91,44.83 | 53.34,44.83 LED92.K | 57.91,44.83 62.48,44.83 | 57.91,44.83 LED102.K | 62.48,44.83 67.06,44.83 | 62.48,44.83 LED112.K | 67.06,44.83 71.63,44.83 | 67.06,44.83 LED122.K | 71.63,44.83 76.2,44.83 | 71.63,44.83 LED132.K | 76.2,44.83 80.77,44.83 | 76.2,44.83 LED142.K | 80.77,44.83 85.34,44.83 | 80.77,44.83 LED152.K | 85.34,44.83 89.92,44.83 | 85.34,44.83 LED162.K | 89.92,44.83 94.49,44.83 | 89.92,44.83 LED172.K | 94.49,44.83 99.06,44.83 LED192.K | 94.49,44.83 LED182.K
N$23
  Bottom 0.61: 16.76,49.4 12.19,49.4 LED3.K 9.1,49.15 T23.3 | 16.76,49.4 21.34,49.4 | 16.76,49.4 LED13.K | 21.34,49.4 25.91,49.4 | 21.34,49.4 LED23.K | 25.91,49.4 30.48,49.4 | 25.91,49.4 LED33.K | 30.48,49.4 35.05,49.4 | 30.48,49.4 LED43.K | 35.05,49.4 39.62,49.4 | 35.05,49.4 LED53.K | 39.62,49.4 44.2,49.4 | 39.62,49.4 LED63.K | 44.2,49.4 48.77,49.4 | 44.2,49.4 LED73.K | 48.77,49.4 53.34,49.4 | 48.77,49.4 LED83.K | 53.34,49.4 57.91,49.4 | 53.34,49.4 LED93.K | 57.91,49.4 62.48,49.4 | 57.91,49.4 LED103.K | 62.48,49.4 67.06,49.4 | 62.48,49.4 LED113.K | 67.06,49.4 71.63,49.4 | 67.06,49.4 LED123.K | 71.63,49.4 76.2,49.4 | 71.63,49.4 LED133.K | 76.2,49.4 80.77,49.4 | 76.2,49.4 LED143.K | 80.77,49.4 85.34,49.4 | 80.77,49.4 LED153.K | 85.34,49.4 89.92,49.4 | 85.34,49.4 LED163.K | 89.92,49.4 94.49,49.4 | 89.92,49.4 LED173.K | LED193.K 99.06,49.4 94.49,49.4 | 94.49,49.4 LED183.K
N$24
  Bottom 0.61: 16.76,53.98 12.19,53.98 LED4.K 9.1,53.72 T24.3 | 16.76,53.98 21.34,53.98 | 16.76,53.98 LED14.K | 21.34,53.98 25.91,53.98 | 21.34,53.98 LED24.K | 25.91,53.98 30.48,53.98 | 25.91,53.98 LED34.K | 30.48,53.98 35.05,53.98 | 30.48,53.98 LED44.K | 35.05,53.98 39.62,53.98 | 35.05,53.98 LED54.K | 39.62,53.98 44.2,53.98 | 39.62,53.98 LED64.K | 44.2,53.98 48.77,53.98 | 44.2,53.98 LED74.K | 48.77,53.98 53.34,53.98 | 48.77,53.98 LED84.K | 53.34,53.98 57.91,53.98 | 53.34,53.98 LED94.K | 57.91,53.98 62.48,53.98 | 57.91,53.98 LED104.K | 62.48,53.98 67.06,53.98 | 62.48,53.98 LED114.K | 67.06,53.98 71.63,53.98 | 67.06,53.98 LED124.K | 71.63,53.98 76.2,53.98 | 71.63,53.98 LED134.K | 76.2,53.98 80.77,53.98 | 76.2,53.98 LED144.K | 80.77,53.98 85.34,53.98 | 80.77,53.98 LED154.K | 85.34,53.98 89.92,53.98 | 85.34,53.98 LED164.K | 89.92,53.98 94.49,53.98 | 89.92,53.98 LED174.K | LED194.K 99.06,53.98 94.49,53.98 | 94.49,53.98 LED184.K
N$25
  Bottom 0.61: 16.76,58.55 12.19,58.55 LED5.K 9.1,58.29 T25.3 | 16.76,58.55 21.34,58.55 | 16.76,58.55 LED15.K | 21.34,58.55 25.91,58.55 | 21.34,58.55 LED25.K | 25.91,58.55 30.48,58.55 | 25.91,58.55 LED35.K | 30.48,58.55 35.05,58.55 | 30.48,58.55 LED45.K | 35.05,58.55 39.62,58.55 | 35.05,58.55 LED55.K | 39.62,58.55 44.2,58.55 | 39.62,58.55 LED65.K | 44.2,58.55 48.77,58.55 | 44.2,58.55 LED75.K | 48.77,58.55 53.34,58.55 | 48.77,58.55 LED85.K | 53.34,58.55 57.91,58.55 | 53.34,58.55 LED95.K | 57.91,58.55 62.48,58.55 | 57.91,58.55 LED105.K | 62.48,58.55 67.06,58.55 | 62.48,58.55 LED115.K | 67.06,58.55 71.63,58.55 | 67.06,58.55 LED125.K | 71.63,58.55 76.2,58.55 | 71.63,58.55 LED135.K | 76.2,58.55 80.77,58.55 | 76.2,58.55 LED145.K | 80.77,58.55 85.34,58.55 | 80.77,58.55 LED155.K | 85.34,58.55 89.92,58.55 | 85.34,58.55 LED165.K | 89.92,58.55 94.49,58.55 | 89.92,58.55 LED175.K | LED195.K 99.06,58.55 94.49,58.55 | 94.49,58.55 LED185.K
N$26
  Bottom 0.61: 16.76,63.12 12.19,63.12 LED6.K 9.1,62.87 T26.3 | 16.76,63.12 21.34,63.12 | 16.76,63.12 LED16.K | 21.34,63.12 25.91,63.12 | 21.34,63.12 LED26.K | 25.91,63.12 30.48,63.12 | 25.91,63.12 LED36.K | 30.48,63.12 35.05,63.12 | 30.48,63.12 LED46.K | 35.05,63.12 39.62,63.12 | 35.05,63.12 LED56.K | 39.62,63.12 44.2,63.12 | 39.62,63.12 LED66.K | 44.2,63.12 48.77,63.12 | 44.2,63.12 LED76.K | 48.77,63.12 53.34,63.12 | 48.77,63.12 LED86.K | 53.34,63.12 57.91,63.12 | 53.34,63.12 LED96.K | 57.91,63.12 62.48,63.12 | 57.91,63.12 LED106.K | 62.48,63.12 67.06,63.12 | 62.48,63.12 LED116.K | 67.06,63.12 71.63,63.12 | 67.06,63.12 LED126.K | 71.63,63.12 76.2,63.12 | 71.63,63.12 LED136.K | 76.2,63.12 80.77,63.12 | 76.2,63.12 LED146.K | 80.77,63.12 85.34,63.12 | 80.77,63.12 LED156.K | 85.34,63.12 89.92,63.12 | 85.34,63.12 LED166.K | 89.92,63.12 94.49,63.12 | 89.92,63.12 LED176.K | LED196.K 99.06,63.12 94.49,63.12 | 94.49,63.12 LED186.K
N$27
  Bottom 0.61: 16.76,67.69 12.19,67.69 LED7.K 9.1,67.44 T27.3 | 16.76,67.69 21.34,67.69 | 16.76,67.69 LED17.K | 21.34,67.69 25.91,67.69 | 21.34,67.69 LED27.K | 25.91,67.69 30.48,67.69 | 25.91,67.69 LED37.K | 30.48,67.69 35.05,67.69 | 30.48,67.69 LED47.K | 35.05,67.69 39.62,67.69 | 35.05,67.69 LED57.K | 39.62,67.69 44.2,67.69 | 39.62,67.69 LED67.K | 44.2,67.69 48.77,67.69 | 44.2,67.69 LED77.K | 48.77,67.69 53.34,67.69 | 48.77,67.69 LED87.K | 53.34,67.69 57.91,67.69 | 53.34,67.69 LED97.K | 57.91,67.69 62.48,67.69 | 57.91,67.69 LED107.K | 62.48,67.69 67.06,67.69 | 62.48,67.69 LED117.K | 67.06,67.69 71.63,67.69 | 67.06,67.69 LED127.K | 71.63,67.69 76.2,67.69 | 71.63,67.69 LED137.K | 76.2,67.69 80.77,67.69 | 76.2,67.69 LED147.K | 80.77,67.69 85.34,67.69 | 80.77,67.69 LED157.K | 85.34,67.69 89.92,67.69 | 85.34,67.69 LED167.K | 89.92,67.69 94.49,67.69 | 89.92,67.69 LED177.K | LED197.K 99.06,67.69 94.49,67.69 | 94.49,67.69 LED187.K
N$28
  Bottom 0.61: 16.76,72.26 12.19,72.26 LED8.K 9.1,72.01 T28.3 | 16.76,72.26 21.34,72.26 | 16.76,72.26 LED18.K | 21.34,72.26 25.91,72.26 | 21.34,72.26 LED28.K | 25.91,72.26 30.48,72.26 | 25.91,72.26 LED38.K | 30.48,72.26 35.05,72.26 | 30.48,72.26 LED48.K | 35.05,72.26 39.62,72.26 | 35.05,72.26 LED58.K | 39.62,72.26 44.2,72.26 | 39.62,72.26 LED68.K | 44.2,72.26 48.77,72.26 | 44.2,72.26 LED78.K | 48.77,72.26 53.34,72.26 | 48.77,72.26 LED88.K | 53.34,72.26 57.91,72.26 | 53.34,72.26 LED98.K | 57.91,72.26 62.48,72.26 | 57.91,72.26 LED108.K | 62.48,72.26 67.06,72.26 | 62.48,72.26 LED118.K | 67.06,72.26 71.63,72.26 | 67.06,72.26 LED128.K | 71.63,72.26 76.2,72.26 | 71.63,72.26 LED138.K | 76.2,72.26 80.77,72.26 | 76.2,72.26 LED148.K | 80.77,72.26 85.34,72.26 | 80.77,72.26 LED158.K | 85.34,72.26 89.92,72.26 | 85.34,72.26 LED168.K | 89.92,72.26 94.49,72.26 | 89.92,72.26 LED178.K | LED198.K 99.06,72.26 94.49,72.26 | 94.49,72.26 LED188.K
N$29
  Bottom 0.61: 16.76,76.83 12.19,76.83 LED9.K 9.1,76.58 T29.3 | 16.76,76.83 21.34,76.83 | 16.76,76.83 LED19.K | 21.34,76.83 25.91,76.83 | 21.34,76.83 LED29.K | 25.91,76.83 30.48,76.83 | 25.91,76.83 LED39.K | 30.48,76.83 35.05,76.83 | 30.48,76.83 LED49.K | 35.05,76.83 39.62,76.83 | 35.05,76.83 LED59.K | 39.62,76.83 44.2,76.83 | 39.62,76.83 LED69.K | 44.2,76.83 48.77,76.83 | 44.2,76.83 LED79.K | 48.77,76.83 53.34,76.83 | 48.77,76.83 LED89.K | 53.34,76.83 57.91,76.83 | 53.34,76.83 LED99.K | 57.91,76.83 62.48,76.83 | 57.91,76.83 LED109.K | 62.48,76.83 67.06,76.83 | 62.48,76.83 LED119.K | 67.06,76.83 71.63,76.83 | 67.06,76.83 LED129.K | 71.63,76.83 76.2,76.83 | 71.63,76.83 LED139.K | 76.2,76.83 80.77,76.83 | 76.2,76.83 LED149.K | 80.77,76.83 85.34,76.83 | 80.77,76.83 LED159.K | 85.34,76.83 89.92,76.83 | 85.34,76.83 LED169.K | 89.92,76.83 94.49,76.83 | 89.92,76.83 LED179.K | LED199.K 99.06,76.83 94.49,76.83 | 94.49,76.83 LED189.K
N$30
  Bottom 0.61: LED200.K 99.06,81.41 94.49,81.41 | 16.76,81.41 12.19,81.41 LED10.K 9.1,81.15 T30.3 | 16.76,81.41 21.34,81.41 | 21.34,81.41 25.91,81.41 | 25.91,81.41 30.48,81.41 | 30.48,81.41 35.05,81.41 | 35.05,81.41 39.62,81.41 | 39.62,81.41 44.2,81.41 | 44.2,81.41 48.77,81.41 | 53.34,81.41 57.91,81.41 | 57.91,81.41 62.48,81.41 | 62.48,81.41 67.06,81.41 | 67.06,81.41 71.63,81.41 | 71.63,81.41 76.2,81.41 | 76.2,81.41 80.77,81.41 | 80.77,81.41 85.34,81.41 | 85.34,81.41 89.92,81.41 | 89.92,81.41 94.49,81.41 | 16.76,81.41 LED20.K | 21.34,81.41 LED30.K | 25.91,81.41 LED40.K | 30.48,81.41 LED50.K | 35.05,81.41 LED60.K | 39.62,81.41 LED70.K | 44.2,81.41 LED80.K | 48.77,81.41 LED90.K | 48.77,81.41 53.34,81.41 | 53.34,81.41 LED100.K | 57.91,81.41 LED110.K | 62.48,81.41 LED120.K | 67.06,81.41 LED130.K | 71.63,81.41 LED140.K | 76.2,81.41 LED150.K | 80.77,81.41 LED160.K | 85.34,81.41 LED170.K | 89.92,81.41 LED180.K | 94.49,81.41 LED190.K
N$31
  Bottom 0.406: T1.B 10.35,28.75 R1.2
N$32
  Bottom 0.406: T2.B 14.93,28.75 R2.2
N$33
  Bottom 0.406: T3.B 19.5,28.75 R3.2
N$34
  Bottom 0.406: T4.B 24.07,28.75 R4.2
N$35
  Bottom 0.406: T5.B 28.64,28.75 R5.2
N$36
  Bottom 0.406: T6.B 33.21,28.75 R6.2
N$37
  Bottom 0.406: T7.B 37.78,28.75 R7.2
N$38
  Bottom 0.406: T8.B 42.36,28.75 R8.2
N$39
  Bottom 0.406: T9.B 46.93,28.75 R9.2
N$40
  Bottom 0.406: T10.B 51.5,28.75 R10.2
N$41
  Bottom 0.406: T11.B 56.07,28.75 R11.2
N$42
  Bottom 0.406: T12.B 60.65,28.75 R12.2
N$43
  Bottom 0.406: T13.B 65.22,28.75 R13.2
N$44
  Bottom 0.406: T14.B 69.79,28.75 R14.2
N$45
  Bottom 0.406: T15.B 74.36,28.75 R15.2
N$46
  Bottom 0.406: T16.B 78.93,28.75 R16.2
N$47
  Bottom 0.406: T17.B 83.5,28.75 R17.2
N$48
  Bottom 0.406: T18.B 88.08,28.75 R18.2
N$49
  Bottom 0.406: T19.B 92.65,28.75 R19.2
N$50
  Bottom 0.406: T20.B 97.22,28.75 R20.2
N$51
  Bottom 0.406: T1.C 12.19,30.06 R21.1
N$52
  Bottom 0.406: R26.1 35.14,32.53 T6.C
N$53
  Bottom 0.406: T2.C 16.76,30.06 R22.1
N$54
  Bottom 0.406: R23.1 21.42,32.53 T3.C
N$55
  Bottom 0.406: T4.C 25.91,30.06 R24.1
N$56
  Bottom 0.406: R25.1 30.56,32.53 T5.C
N$57
  Bottom 0.406: R27.1 39.71,32.53 T7.C
N$58
  Bottom 0.406: T8.C 44.2,30.06 R28.1
N$59
  Bottom 0.406: T9.C 48.77,30.06 R29.1
N$60
  Bottom 0.406: R30.1 53.42,32.53 T10.C
N$61
  Bottom 0.406: T11.C 57.91,30.06 R31.1
N$62
  Bottom 0.406: T12.C 62.48,30.06 R32.1
N$63
  Bottom 0.406: T13.C 67.06,30.06 R33.1
N$64
  Bottom 0.406: T14.C 71.63,30.06 R34.1
N$65
  Bottom 0.406: T15.C 76.2,30.06 R35.1
N$66
  Bottom 0.406: T16.C 80.77,30.06 R36.1
N$67
  Bottom 0.406: T17.C 85.34,30.06 R37.1
N$68
  Bottom 0.406: R38.1 90,32.53 T18.C
N$69
  Bottom 0.406: R39.1 94.57,32.53 T19.C
N$70
  Bottom 0.406: R40.1 99.14,32.53 T20.C
N$71
  Top 0.61: 97.54,41.78 97.54,38.99 LED191.A | 97.54,41.78 97.54,46.35 | 97.54,46.35 97.54,50.93 | 97.54,50.93 97.54,55.5 | 97.54,55.5 97.54,60.07 | 97.54,60.07 97.54,64.64 | 97.54,64.64 97.54,69.22 | 97.54,69.22 97.54,73.79 | 97.54,73.79 97.54,78.36 99.06,78.36 LED200.A | 97.54,73.79 99.06,73.79 LED199.A | 97.54,69.22 99.06,69.22 LED198.A | 97.54,64.64 99.06,64.64 LED197.A | 97.54,60.07 99.06,60.07 LED196.A | LED195.A 99.06,55.5 97.54,55.5 | LED194.A 99.06,50.93 97.54,50.93 | LED193.A 99.06,46.35 97.54,46.35 | LED192.A 99.06,41.78 97.54,41.78
  Bottom 0.61: R40.2 LED191.A
N$72
  Top 0.61: 88.39,46.35 89.92,46.35 LED173.A | 88.39,50.93 89.92,50.93 LED174.A | 88.39,46.35 88.39,50.93 | 88.39,55.5 89.92,55.5 LED175.A | 88.39,50.93 88.39,55.5 | 88.39,60.07 89.92,60.07 LED176.A | 88.39,55.5 88.39,60.07 | 88.39,64.64 89.92,64.64 LED177.A | 88.39,60.07 88.39,64.64 | 88.39,69.22 89.92,69.22 LED178.A | 88.39,64.64 88.39,69.22 | 88.39,73.79 89.92,73.79 LED179.A | 88.39,69.22 88.39,73.79 | 88.39,73.79 88.39,78.36 89.92,78.36 LED180.A | 88.39,41.78 88.39,38.99 LED171.A | 88.39,41.78 88.39,46.35 | 88.39,41.78 89.92,41.78 LED172.A
  Bottom 0.61: R38.2 LED171.A
N$73
  Top 0.61: 71.63,37.21 70.1,38.73 70.1,41.78 | 70.1,41.78 71.63,41.78 LED132.A | 70.1,46.35 71.63,46.35 LED133.A | 70.1,41.78 70.1,46.35 | 70.1,50.93 71.63,50.93 LED134.A | 70.1,46.35 70.1,50.93 | 70.1,55.5 71.63,55.5 LED135.A | 70.1,50.93 70.1,55.5 | 70.1,60.07 71.63,60.07 LED136.A | 70.1,55.5 70.1,60.07 | 70.1,64.64 71.63,64.64 LED137.A | 70.1,60.07 70.1,64.64 | 70.1,69.22 71.63,69.22 LED138.A | 70.1,64.64 70.1,69.22 | 70.1,73.79 71.63,73.79 LED139.A | 70.1,69.22 70.1,73.79 | 70.1,73.79 70.1,78.36 71.63,78.36 LED140.A | 71.63,37.21 71.37,37.21 | LED131.A 71.63,37.21
  Bottom 0.61: R34.2 LED131.A
N$74  (via drill 0.9 pad 1.52)
  Top 0.406: v-1.02,49.78 2.54,49.78 7.62,44.7 7.62,35.05 32,10.67 55.37,10.67 56.39,9.65 56.39,0.25 IC1.6
  Bottom 0.406: SV2.4 35.81,-3.05 54.36,-3.05 56.13,-1.27 IC1.6 | R49.1 -3.05,70.1 -3.05,49.78 | -3.05,49.78 -3.05,47.24 R44.1 | v-1.02,49.78 -3.05,49.78
N$75  (via drill 0.9 pad 1.52)
  Top 0.406: IC1.7 58.67,10.92 57.91,11.68 32.51,11.68 8.64,35.56 8.64,45.72 0,54.36 v-0.51,54.36
  Bottom 0.406: SV2.1 35.31,2.54 56.9,2.54 58.67,0.76 IC1.7 | R48.1 -2.03,65.53 -2.03,54.36 | R45.1 -2.03,51.82 -2.03,53.85 -2.03,54.36 | v-0.51,54.36 -2.03,54.36
N$76
  Bottom 0.406: IC1.20 93.47,1.78 93.47,21.84 89.98,24.83 R18.1
N$77
  Bottom 0.406: R17.1 85.34,26.99 85.34,26.42 91.69,20.07 IC1.21
N$78  (via drill 0.9 pad 1.52)
  Top 0.406: IC1.8 61.21,10.92 59.44,12.7 33.02,12.7 9.65,36.07 9.65,48.77 v0,58.42
  Bottom 0.406: SV2.3 34.29,4.57 36.58,4.57 37.59,3.56 58.93,3.56 61.21,1.27 IC1.8 | R47.1 -1.02,60.96 -1.02,58.42 | -1.02,58.42 -1.02,56.39 R46.1 | v0,58.42 -1.02,58.42
N$79
  Bottom 0.406: R16.1 89.15,18.73 IC1.22
N$80
  Bottom 0.406: IC1.12 71.63,0.25 71.63,2.03 72.9,3.3 Q1.2 72.9,8.82 C1.1
N$81
  Bottom 0.406: IC1.13 74.17,0.25 74.17,1.52 75.69,3.05 81.28,3.05 82.55,4.32 Q1.1 82.55,8.32 C2.1
N$82
  Bottom 0.406: SV1.4 104.65,8.38 104.65,2.03 96.77,-5.84 82.04,-5.84 76.45,-0.25 IC1.14
N$83
  Bottom 0.406: SV1.6 103.63,6.86 103.63,2.29 96.27,-5.08 84.07,-5.08 IC1.15
N$84
  Bottom 0.406: SV1.8 102.87,5.08 102.87,3.05 95.25,-4.32 85.6,-4.32 81.53,-0.25 IC1.16
N$85
  Bottom 0.406: SV1.10 101.35,3.3 94.49,-3.56 87.12,-3.56 84.07,-0.51 IC1.17
N$86
  Bottom 0.406: R15.1 86.61,16.7 IC1.23
N$87
  Bottom 0.406: R14.1 73.59,25.15 74.42,25.15 84.07,15.49 IC1.24
N$88
  Bottom 0.406: R13.1 69.28,24.89 72.14,24.89 81.53,15.49 IC1.25
N$89
  Bottom 0.406: R12.1 65.72,23.88 71.63,23.88 78.99,16.51 IC1.26
N$90
  Bottom 0.406: R11.1 62.16,22.86 71.12,22.86 76.45,17.53 IC1.27
N$91
  Bottom 0.406: R10.1 58.61,21.84 70.61,21.84 73.91,18.54 IC1.28
N$92
  Bottom 0.61: IC3.1 17.02,0.25 C3.+ 21.57,0.49 C6.1
  Bottom 1.016: D3.C 12.45,1.02 IC3.1
N$93
  Bottom 1.016: U$1.I 3.56,10.67 10.16,10.67 12.19,8.64 D3.A
N$94
  Bottom 0.406: R42.2 3.01,38.17 T21.1
N$95
  Bottom 0.406: R9.1 55.05,20.83 70.1,20.83 71.37,19.56 IC1.29
N$96
  Bottom 0.406: R8.1 46.42,24.89 48.77,24.89 53.85,19.81 59.69,19.81 61.21,18.29 IC1.33
N$97
  Bottom 0.406: R7.1 42.86,23.88 48.26,23.88 53.34,18.8 57.66,18.8 58.67,17.78 IC1.34
N$98
  Bottom 0.406: R6.1 39.3,22.86 47.75,22.86 52.83,17.78 55.88,17.78 56.13,17.53 IC1.35
N$99
  Bottom 0.406: R5.1 35.75,21.84 47.24,21.84 53.59,15.49 IC1.36
N$100
  Bottom 0.406: R4.1 32.19,20.83 46.74,20.83 51.05,16.51 IC1.37
N$101
  Bottom 0.406: R3.1 28.64,19.81 46.23,19.81 48.51,17.53 IC1.38
N$102
  Bottom 0.406: R2.1 18.48,25.4 21.34,25.4 27.94,18.8 43.69,18.8 45.97,16.51 IC1.39
N$103
  Bottom 0.406: R1.1 14.92,24.38 20.83,24.38 27.43,17.78 41.15,17.78 43.43,15.49 IC1.40
N$104
  Bottom 0.406: R43.2 6.01,42.67 T22.1
N$105
  Bottom 0.406: R44.2 6.01,47.24 T23.1
N$106
  Bottom 0.406: R45.2 6.01,51.82 T24.1
N$107
  Bottom 0.406: T25.1 2.95,56.45 R46.2
N$108
  Bottom 0.406: R47.2 6.01,60.96 T26.1
N$109
  Bottom 0.406: T27.1 2.95,65.6 R48.2
N$110
  Bottom 0.406: T28.1 2.95,70.17 R49.2
N$111
  Bottom 0.406: T29.1 2.95,74.74 R50.2
N$112
  Bottom 0.406: T30.1 2.95,79.31 R51.2
N$113
  Bottom 0.406: R52.2 3.13,35.03 T31.1
N$114
  Bottom 0.406: R53.2 3.13,28.43 T32.1
N$115  (via drill 0.9 pad 1.52)
  Top 0.406: v11.68,24.38 13.72,24.38 30.48,7.62 46.74,7.62 48.51,5.84 IC1.3
  Bottom 0.406: R52.1 8.13,32.92 8.13,25.91 9.65,24.38 v11.68,24.38
N$116  (via drill 0.9 pad 1.52)
  Top 0.406: v-1.52,45.21 5.08,45.21 6.6,43.69 6.6,34.54 31.5,9.65 52.32,9.65 53.59,8.38 IC1.5
  Bottom 0.406: R50.1 -4.06,74.68 -4.06,45.21 | -4.06,45.21 -4.06,42.67 R43.1 | v-1.52,45.21 -4.06,45.21
N$117  (via drill 0.9 pad 1.52)
  Top 0.406: v-2.03,40.64 4.57,40.64 5.59,39.62 5.59,34.04 30.99,8.64 49.28,8.64 51.05,6.86 IC1.4
  Bottom 0.406: -5.08,40.64 -5.08,38.1 R42.1 | -5.08,40.64 v-2.03,40.64 | -5.08,40.64 -5.08,75.18 -1.02,79.25 R51.1
N$118
  Bottom 0.406: T25.2 1.52,58.35 1.52,53.78 | 1.52,40.13 1.52,44.64 | 1.52,40.13 6.01,40.13 T21.2 | 1.52,44.64 T22.2 | 1.52,44.64 1.52,49.21 | 1.52,49.21 T23.2 | 1.52,49.21 1.52,53.78 | 1.52,53.78 T24.2 | T31.3 1.52,32.6 1.52,40.13
N$119
  Bottom 0.406: 1.52,81.21 T30.2 | 1.52,67.5 1.52,62.99 6.01,62.99 T26.2 | 1.52,67.5 T27.2 | 1.52,72.07 1.52,67.5 | 1.52,72.07 T28.2 | 1.52,76.64 1.52,72.07 | 1.52,76.64 T29.2 | 1.52,81.21 1.52,76.64 | T32.3 -6.1,32.43 -6.1,76.2 -1.08,81.21 1.52,81.21
N$120  (via drill 0.9 pad 1.52)
  Top 0.406: v13.21,22.35 14.22,22.35 29.97,6.6 44.7,6.6 45.97,5.33 IC1.2
  Bottom 0.406: R53.1 7.11,27.33 7.11,25.4 10.16,22.35 v13.21,22.35
N$121
  Top 0.406: LED201.A 14.99,13.21 R54.2
N$122
  Top 0.406: R54.1 21.84,13.21 29.46,5.59 42.16,5.59 43.43,4.32 IC1.1

## Text on the board
Top: 2012-10-29 | 10x20 graphical LED display | Supply | ICP
Bottom: 2012-10-29